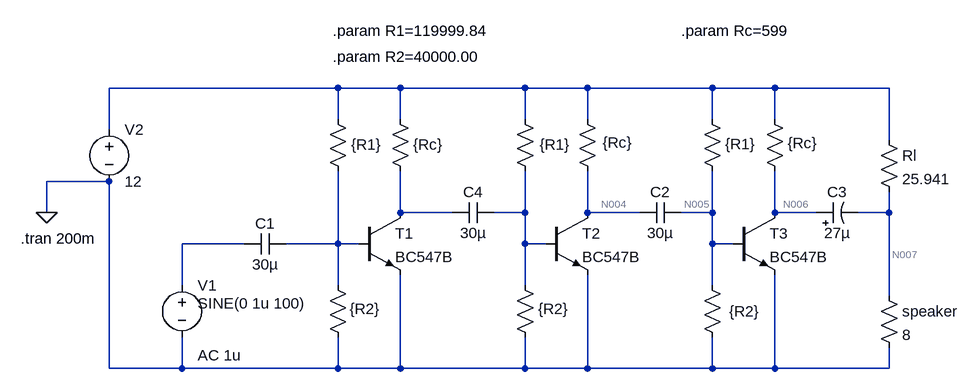
[diagram p0: schematic serial-amplifier.asc]
serial-amplifier.asc, the LTspice schematic file:
Version 4
SHEET 1 1800 680
WIRE 16 16 -336 16
WIRE 112 16 16 16
WIRE 304 16 112 16
WIRE 400 16 304 16
WIRE 592 16 400 16
WIRE 688 16 592 16
WIRE 864 16 688 16
WIRE 16 64 16 16
WIRE 112 64 112 16
WIRE 304 64 304 16
WIRE 400 64 400 16
WIRE 592 64 592 16
WIRE 688 64 688 16
WIRE -336 80 -336 16
WIRE 864 96 864 16
WIRE -336 160 -432 160
WIRE -432 208 -432 160
WIRE 112 208 112 144
WIRE 192 208 112 208
WIRE 304 208 304 144
WIRE 304 208 256 208
WIRE 400 208 400 144
WIRE 480 208 400 208
WIRE 592 208 592 144
WIRE 592 208 544 208
WIRE 688 208 688 144
WIRE 752 208 688 208
WIRE 864 208 864 176
WIRE 864 208 816 208
WIRE -128 256 -224 256
WIRE 16 256 16 144
WIRE 16 256 -64 256
WIRE 48 256 16 256
WIRE 304 256 304 208
WIRE 336 256 304 256
WIRE 592 256 592 208
WIRE 624 256 592 256
WIRE -224 320 -224 256
WIRE 16 320 16 256
WIRE 304 320 304 256
WIRE 592 320 592 256
WIRE 864 336 864 208
WIRE -336 448 -336 160
WIRE -224 448 -224 400
WIRE -224 448 -336 448
WIRE 16 448 16 400
WIRE 16 448 -224 448
WIRE 112 448 112 304
WIRE 112 448 16 448
WIRE 304 448 304 400
WIRE 304 448 112 448
WIRE 400 448 400 304
WIRE 400 448 304 448
WIRE 592 448 592 400
WIRE 592 448 400 448
WIRE 688 448 688 304
WIRE 688 448 592 448
WIRE 864 448 864 416
WIRE 864 448 688 448
FLAG -432 208 0
SYMBOL npn 48 208 R0
SYMATTR InstName T1
SYMATTR Value BC547B
SYMBOL voltage -336 64 R0
WINDOW 123 0 0 Left 0
WINDOW 39 0 0 Left 0
SYMATTR InstName V2
SYMATTR Value 12
SYMBOL res 0 48 R0
WINDOW 0 36 40 Invisible 2
WINDOW 3 36 55 Left 2
SYMATTR InstName R1
SYMATTR Value {R1}
SYMBOL res 0 304 R0
WINDOW 0 36 40 Invisible 2
WINDOW 3 34 52 Left 2
SYMATTR InstName R2
SYMATTR Value {R2}
SYMBOL res 96 48 R0
WINDOW 0 36 40 Invisible 2
WINDOW 3 36 55 Left 2
SYMATTR InstName Rc1
SYMATTR Value {Rc}
SYMBOL cap -128 272 R270
WINDOW 0 32 32 VTop 2
WINDOW 3 0 32 VBottom 2
SYMATTR InstName C1
SYMATTR Value 30µ
SYMBOL voltage -224 304 R0
WINDOW 123 24 124 Left 2
WINDOW 39 0 0 Left 0
WINDOW 3 24 44 Left 2
SYMATTR Value2 AC 1u
SYMATTR Value SINE(0 1u 100)
SYMATTR InstName V1
SYMBOL res 848 320 R0
SYMATTR InstName speaker
SYMATTR Value 8
SYMBOL cap 192 224 R270
WINDOW 0 32 32 VTop 2
WINDOW 3 0 32 VBottom 2
SYMATTR InstName C4
SYMATTR Value 30µ
SYMBOL npn 336 208 R0
SYMATTR InstName T2
SYMATTR Value BC547B
SYMBOL res 288 48 R0
WINDOW 0 36 40 Invisible 2
WINDOW 3 38 55 Left 2
SYMATTR InstName R3
SYMATTR Value {R1}
SYMBOL res 288 304 R0
WINDOW 0 36 40 Invisible 2
WINDOW 3 36 52 Left 2
SYMATTR InstName R4
SYMATTR Value {R2}
SYMBOL res 384 48 R0
WINDOW 0 36 40 Invisible 2
WINDOW 3 39 52 Left 2
SYMATTR InstName Rc2
SYMATTR Value {Rc}
SYMBOL cap 480 224 R270
WINDOW 0 32 32 VTop 2
WINDOW 3 0 32 VBottom 2
SYMATTR InstName C2
SYMATTR Value 30µ
SYMBOL npn 624 208 R0
SYMATTR InstName T3
SYMATTR Value BC547B
SYMBOL res 576 48 R0
WINDOW 0 36 40 Invisible 2
WINDOW 3 36 54 Left 2
SYMATTR InstName R5
SYMATTR Value {R1}
SYMBOL res 576 304 R0
WINDOW 0 36 40 Invisible 2
WINDOW 3 42 56 Left 2
SYMATTR InstName R6
SYMATTR Value {R2}
SYMBOL res 672 48 R0
WINDOW 0 36 40 Invisible 2
WINDOW 3 36 53 Left 2
SYMATTR InstName Rc3
SYMATTR Value {Rc}
SYMBOL res 848 80 R0
SYMATTR InstName Rl
SYMATTR Value 25.941
SYMBOL polcap 752 224 R270
WINDOW 0 32 32 VTop 2
WINDOW 3 0 32 VBottom 2
SYMATTR InstName C3
SYMATTR Value 27µ
SYMATTR Description Capacitor
SYMATTR Type cap
SYMATTR SpiceLine V=10 Irms=72m Rser=1.07993 Lser=3.28912n mfg="Würth Elektronik" pn="860160272002 WCAP-ATLL 5x11" type="Al electrolytic"
TEXT -472 248 Left 2 !.tran 200m
TEXT 544 -72 Left 2 !.param Rc=599
TEXT 8 -72 Left 2 !.param R1=119999.84
TEXT 8 -32 Left 2 !.param R2=40000.00

The netlist it stands for:
* serial-amplifier.asc
Q§T1 N002 N009 0 0 BC547B
V2 N001 0 12
R1 N001 N009 {R1}
R2 N009 0 {R2}
Rc1 N001 N002 {Rc}
C1 N008 N009 30µ
V1 N008 0 SINE(0 1u 100) AC 1u
R§speaker N007 0 8
C4 N002 N003 30µ
Q§T2 N004 N003 0 0 BC547B
R3 N001 N003 {R1}
R4 N003 0 {R2}
Rc2 N001 N004 {Rc}
C2 N004 N005 30µ
Q§T3 N006 N005 0 0 BC547B
R5 N001 N005 {R1}
R6 N005 0 {R2}
Rc3 N001 N006 {Rc}
Rl N001 N007 25.941
C3 N006 N007 27µ V=10 Irms=72m Rser=1.07993 Lser=3.28912n mfg="Würth Elektronik" pn="860160272002 WCAP-ATLL 5x11" type="Al electrolytic"
.model NPN NPN
.model PNP PNP
.lib standard.bjt
.tran 200m
.param Rc=599
.param R1=119999.84
.param R2=40000.00
.backanno
.end

* Results of the author's LTspice run, read from the files saved beside the schematic
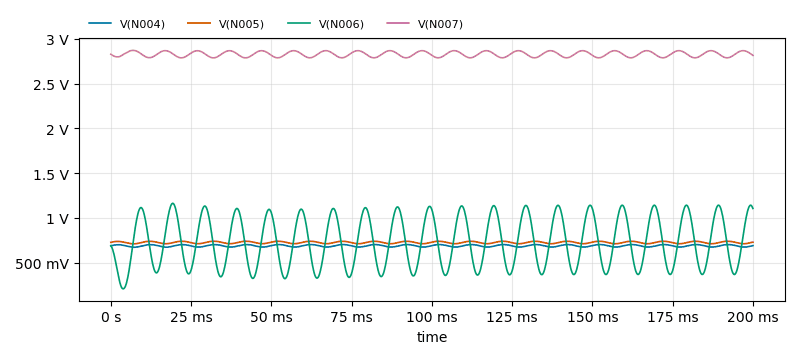
[diagram p1: Transient Analysis of serial-amplifier.asc, plotted from the saved traces]
* Transient Analysis, 1 run:
*   V(N004): min 672.9 mV, max 702.6 mV, average 689 mV, rms 689 mV, last 691.3 mV
*   V(N005): min 710.6 mV, max 739.8 mV, average 726.3 mV, rms 726.4 mV, last 730.1 mV
*   V(N006): min 208.8 mV, max 1.163 V, average 735.9 mV, rms 786.6 mV, last 1.106 V
*   V(N007): min 2.787 V, max 2.871 V, average 2.829 V, rms 2.829 V, last 2.816 V